# EAGLE design DAU_Kupplung_1_phasig_V1_16 (EAGLE 6.1)
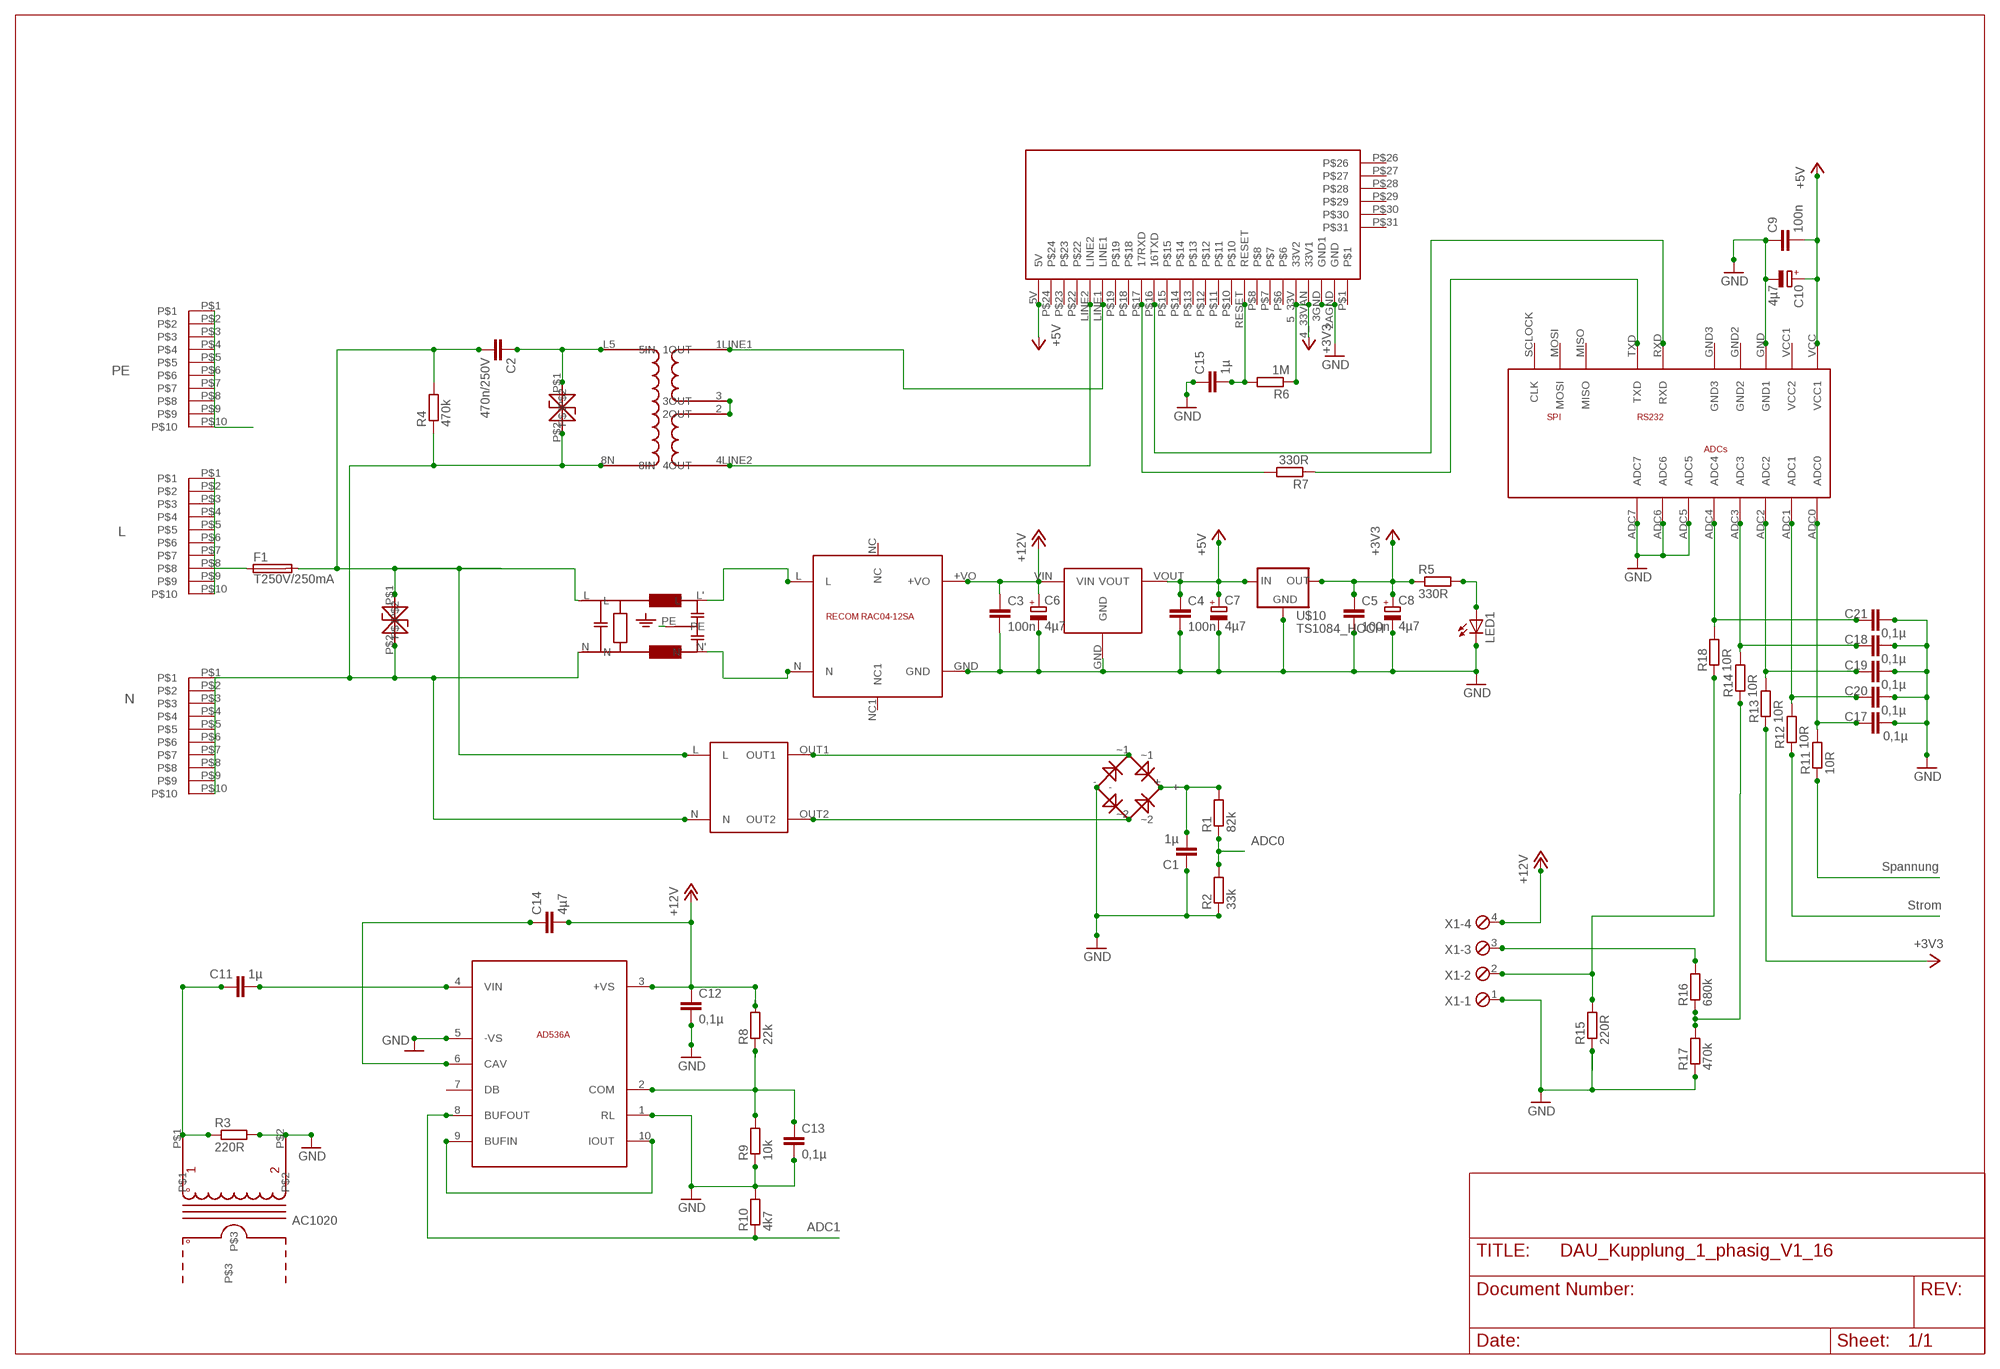
[diagram p0: schematic, sheet 1]

## Parts
AC1020  AC1010  [AC1010]
C1  1µ  C2,5-3  [C2.5-3]
C2  470n/250V  C-EU150-072X183  [C150-072X183]
C3  100n  C-EUC0805  [C0805]
C4  100n  C-EUC0805  [C0805]
C5  100n  C-EUC0805  [C0805]
C6  4µ7  CPOL-EUE2-4  [E2-4]
C7  4µ7  CPOL-EUE2-4  [E2-4]
C8  4µ7  CPOL-EUE2-4  [E2-4]
C9  100n  C-EUC0805  [C0805]
C10  4µ7  CPOL-EUE2-4  [E2-4]
C11  1µ  C-EUC0805  [C0805]
C12  0,1µ  C-EUC0805  [C0805]
C13  0,1µ  C-EUC0805  [C0805]
C14  4µ7  C-EUC0805  [C0805]
C15  1µ  C-EUC0805  [C0805]
C17  0,1µ  C-EUC0805  [C0805]
C18  0,1µ  C-EUC0805  [C0805]
C19  0,1µ  C-EUC0805  [C0805]
C20  0,1µ  C-EUC0805  [C0805]
C21  0,1µ  C-EUC0805  [C0805]
F1  T250V/250mA  TR5  [TR5]
L  PRINT_CONNECTOR  [FASTON_DOUBLE]
LED1  LEDSQR2X5  [LED2X5]
N  PRINT_CONNECTOR  [FASTON_DOUBLE]
PE  PRINT_CONNECTOR  [FASTON_DOUBLE]
R1  82k  R-EU_R1206  [R1206]
R2  33k  R-EU_R1206  [R1206]
R3  220R  R-EU_R1206  [R1206]
R4  470k  R-EU_0204/7  [0204/7]
R5  330R  R-EU_R1206  [R1206]
R6  1M  R-EU_R1206  [R1206]
R7  330R  R-EU_R1206  [R1206]
R8  22k  R-EU_R1206  [R1206]
R9  10k  R-EU_R1206  [R1206]
R10  4k7  R-EU_R1206  [R1206]
R11  10R  R-EU_R1206  [R1206]
R12  10R  R-EU_R1206  [R1206]
R13  10R  R-EU_R1206  [R1206]
R14  10R  R-EU_R1206  [R1206]
R15  220R  R-EU_R1206  [R1206]
R16  680k  R-EU_R1206  [R1206]
R17  470k  R-EU_R1206  [R1206]
R18  10R  R-EU_R1206  [R1206]
U$1  RECOM_RAC04_12SA  [RAC04_12SA]
U$2  SICHERHEITSTRAFO  [TRAFO_0,35VA]
U$3  ADUC831_MINIMUM  [ADUC_MINIMUM]
U$4  IT800  [IT800]
U$5  PLC_UEBERTRAGER_V2  [PLC-UEBERTRAGER_V2]
U$6  NETZFILTER_05_A  [NETZFILTER]
U$7  AD536  [TO100_10PIN]
U$8  RECTIFIER  [RECTIFIER]
U$9  TSV  [TSV]
U$10  TS1084_HOCH  [TS1084_HOCH]
U$11  RECOM_785_05  [RECOM785X]
U$12  TSV  [TSV]
X1  MPT4  [4POL254]

## Nets
+3V3: C5.1 C8.+ R5.1 R6.1 R13.1 U$4.4_33VAN(33V1) U$4.5_33V(33V2) U$10.OUT
+5V: C4.1 C7.+ C9.2 C10.+ U$3.VCC(VCC1) U$4.5V U$10.IN U$11.VOUT
+12V: C3.1 C6.+ C12.1 C14.2 R8.2 U$1.+VO U$7.3(+VS) U$11.VIN X1.4
ADC0: R1.1 R2.2 R11.1
ADC1: R10.1 R12.1 U$7.8(BUFOUT)
GND: AC1020.P$2 C1.1 C3.2 C4.2 C5.2 C6.- C7.- C8.- C9.1 C10.- C12.2 C13.2 C15.1 C17.2 C18.2 C19.2 C20.2 C21.2 LED1.K(C) R2.1 R3.2 R9.1 R10.2 R15.1 R17.1 U$1.GND U$3.ADC5 U$3.ADC6 U$3.ADC7 U$3.GND(GND1) U$4.2AGND(GND) U$4.3GND(GND1) U$7.1(RL) U$7.5(-VS) U$8.- U$10.GND U$11.GND X1.1
N$1: U$5.2(2OUT) U$5.3(3OUT)
N$2: U$7.9(BUFIN) U$7.10(IOUT)
N$3: R7.2 U$4.P$17(17RXD)
N$4: U$2.OUT1 U$8.~1
N$5: U$4.LINE1 U$5.1LINE1(1OUT)
N$6: F1.1 L.P$1 L.P$2 L.P$3 L.P$4 L.P$5 L.P$6 L.P$7 L.P$8 L.P$9 L.P$10
N$7: C1.2 R1.2 U$8.+
N$8: AC1020.P$1 C11.1 R3.1
N$9: U$2.OUT2 U$8.~2
N$10: C11.2 U$7.4(VIN)
N$11: C2.1 U$5.L5(5IN) U$12.P$1
N$13: U$4.LINE2 U$5.4LINE2(4OUT)
N$14: R7.1 U$3.TXD
N$15: U$3.RXD U$4.P$16(16TXD)
N$16: C14.1 U$7.6(CAV)
N$17: C21.1 R18.2 U$3.ADC4
N$18: U$1.L U$6.L'
N$19: LED1.A R5.2
N$20: C15.2 R6.2 U$4.RESET
N$21: C13.1 R8.1 R9.2 U$7.2(COM)
N$22: U$1.N U$6.N'
N$23: N.P$1 N.P$2 N.P$3 N.P$4 N.P$5 N.P$6 N.P$7 N.P$8 N.P$9 N.P$10 R4.1 U$2.N U$5.8N(8IN) U$6.N U$9.P$2 U$12.P$2
N$24: C2.2 F1.2 R4.2 U$2.L U$6.L U$9.P$1
N$27: C18.1 R14.2 U$3.ADC3
N$28: C19.1 R13.2 U$3.ADC2
N$29: C20.1 R12.2 U$3.ADC1
N$30: C17.1 R11.2 U$3.ADC0
N$31: R15.2 R18.1 X1.2
N$32: R16.2 X1.3
N$33: R14.1 R16.1 R17.2
PE: PE.P$1 PE.P$2 PE.P$3 PE.P$4 PE.P$5 PE.P$6 PE.P$7 PE.P$8 PE.P$9 PE.P$10 U$6.PE
Unconnected: AC1020.P$3 U$1.NC U$1.NC1 U$3.GND2 U$3.GND3 U$3.MISO U$3.MOSI U$3.SCLOCK(CLK) U$3.VCC1(VCC2) U$4.P$1 U$4.P$6 U$4.P$7 U$4.P$8 U$4.P$10 U$4.P$11 U$4.P$12 U$4.P$13 U$4.P$14 U$4.P$15 U$4.P$18 U$4.P$19 U$4.P$22 U$4.P$23 U$4.P$24 U$4.P$26 U$4.P$27 U$4.P$28 U$4.P$29 U$4.P$30 U$4.P$31 U$7.7(DB)

## Notes on the sheet
- PE
- L
- N
- ADC0
- Spannung
- Strom
- AC1020
- ADC1

## Library data of the parts
AC1020 = ADS:AC1010
C1 = capacitor-wima:C: CAPACITOR naming: grid - package width
C2-C5 C15 C17-C21 = resistor:C-EU: CAPACITOR, European symbol
C6-C8 C10 = rcl:CPOL-EU: POLARIZED CAPACITOR, European symbol
C9 C11-C14 = rcl:C-EU: CAPACITOR, European symbol
F1 = fuse:TR5: FUSE Wickmann; OC_FARNELL: unknown; OC_NEWARK: unknown
L N PE = ADS:PRINT_CONNECTOR
LED1 = led:LED: LED OSRAM: - CHIPLED LG R971, LG N971, LY N971, LG Q971, LY Q971, LO R971, LY R971 LH N974, LH R974 LS Q976, LO Q976, LY Q976 LO Q996 - Hyper CHIPLED LW Q18S LB Q993, LB Q99A, LB R99A - SideLED LS A670, LO A670, LY A670, LG A670, LP A670 LB A673, LV A673, LT A673, LW A673 LH A674 LY A675 LS A676, LA A676, LO A676, LY A676, LW A676 LS A679, LY A679, LG A679 - Hyper Micro SIDELED® LS Y876, LA Y876, LO Y876, LY Y876 LT Y87S - SmartLED LW L88C, LW L88S LB L89C, LB L89S, LG L890 LS L89K, LO L89K, LY L89K LS L896, LA L896, LO L896, LY L896 - TOPLED LS T670, LO T670, LY T670, LG T670, LP T670 LSG T670, LSP T670, LSY T670, LOP T670, LYG T670 LG T671, LOG T671, LSG T671 LB T673, LV T673, LT T673, LW T673 LH T674 LS T676, LA T676, LO T676, LY T676, LB T676, LH T676, LSB T676, LW T676 LB T67C, LV T67C, LT T67C, LS T67K, LO T67K, LY T67K, LW E67C LS E67B, LA E67B, LO E67B, LY E67B, LB E67C, LV E67C, LT E67C LW T67C LS T679, LY T679, LG T679 LS T770, LO T770, LY T770, LG T770, LP T770 LB T773, LV T773, LT T773, LW T773 LH T774 LS E675, LA E675, LY E675, LS T675 LS T776, LA T776, LO T776, LY T776, LB T776 LHGB T686 LT T68C, LB T68C - Hyper Mini TOPLED® LB M676 - Mini TOPLED Santana® LG M470 LS M47K, LO M47K, LY M47K Source: http://www.osram.convergy.de LUXEON: - LUMILED® LXK2-PW12-R00, LXK2-PW12-S00, LXK2-PW14-U00, LXK2-PW14-V00 LXK2-PM12-R00, LXK2-PM12-S00, LXK2-PM14-U00 LXK2-PE12-Q00, LXK2-PE12-R00, LXK2-PE12-S00, LXK2-PE14-T00, LXK2-PE14-U00 LXK2-PB12-K00, LXK2-PB12-L00, LXK2-PB12-M00, LXK2-PB14-N00, LXK2-PB14-P00, LXK2-PB14-Q00 LXK2-PR12-L00, LXK2-PR12-M00, LXK2-PR14-Q00, LXK2-PR14-R00 LXK2-PD12-Q00, LXK2-PD12-R00, LXK2-PD12-S00 LXK2-PH12-R00, LXK2-PH12-S00 LXK2-PL12-P00, LXK2-PL12-Q00, LXK2-PL12-R00 Source: www.luxeon.com KINGBRIGHT: KA-3528ASYC Source: www.kingbright.com
R1-R18 = resistor:R-EU_: RESISTOR, European symbol
U$1 = ADS:RECOM_RAC04_12SA
U$2 = ADS:SICHERHEITSTRAFO
U$3 = ADS_ADUCBoards:ADUC831_MINIMUM
U$4 = ADS:IT800
U$5 = ADS1:PLC_UEBERTRAGER_V2
U$6 = ADS:NETZFILTER_05_A
U$7 = ADS:AD536
U$8 = ADS:RECTIFIER
U$9 U$12 = ADS:TSV
U$10 = ADS:TS1084_HOCH
U$11 = ADS:RECOM_785_05
X1 = con-phoenix-254:MPT4: PHOENIX CONNECTOR; OC_FARNELL: unknown; OC_NEWARK: unknown

## Board
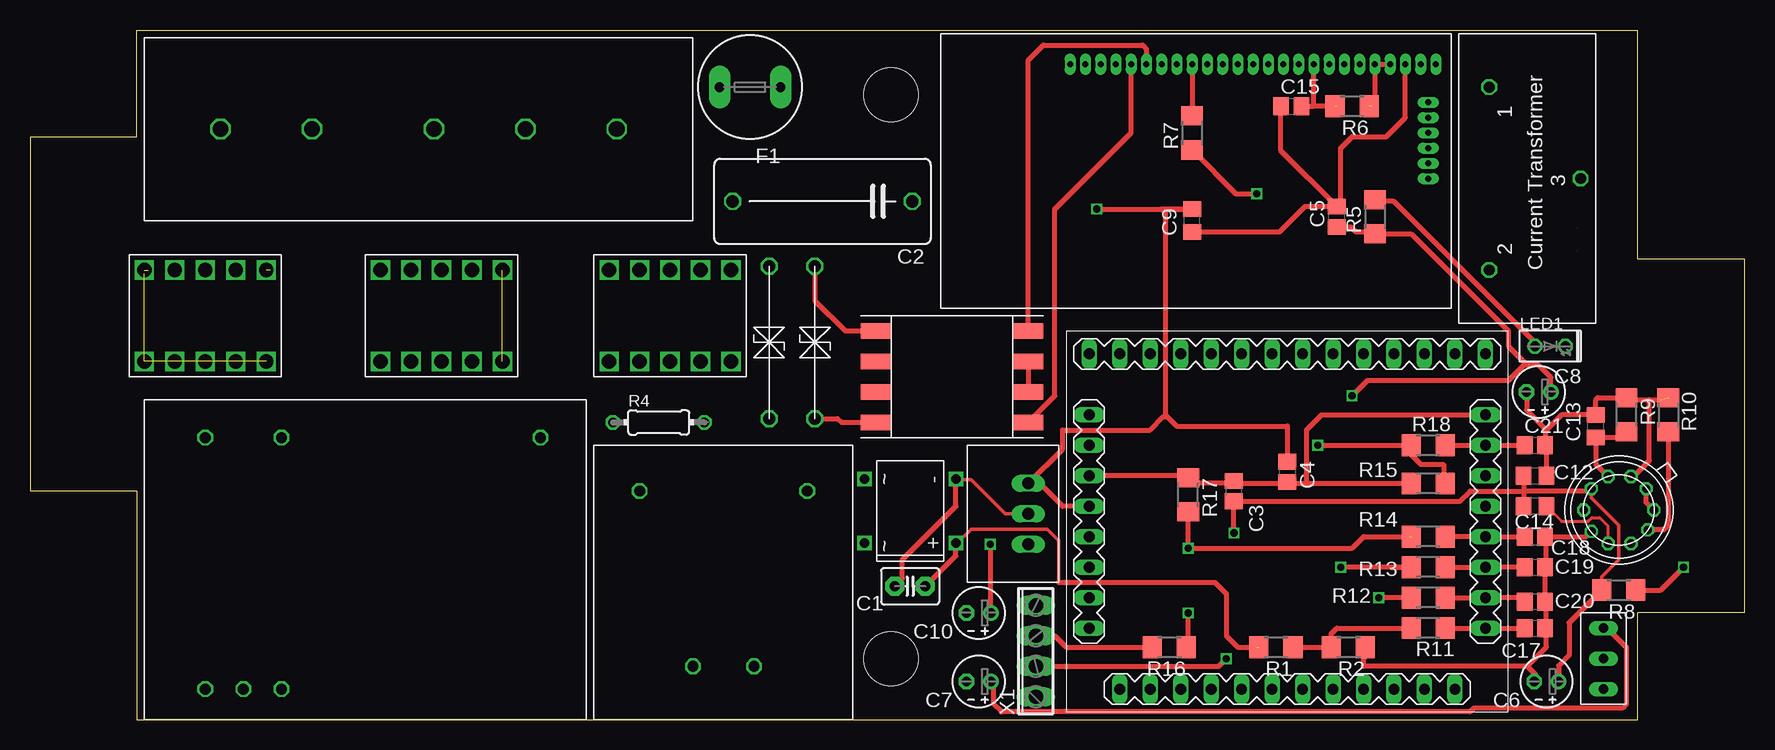
[diagram p1: board, top side]
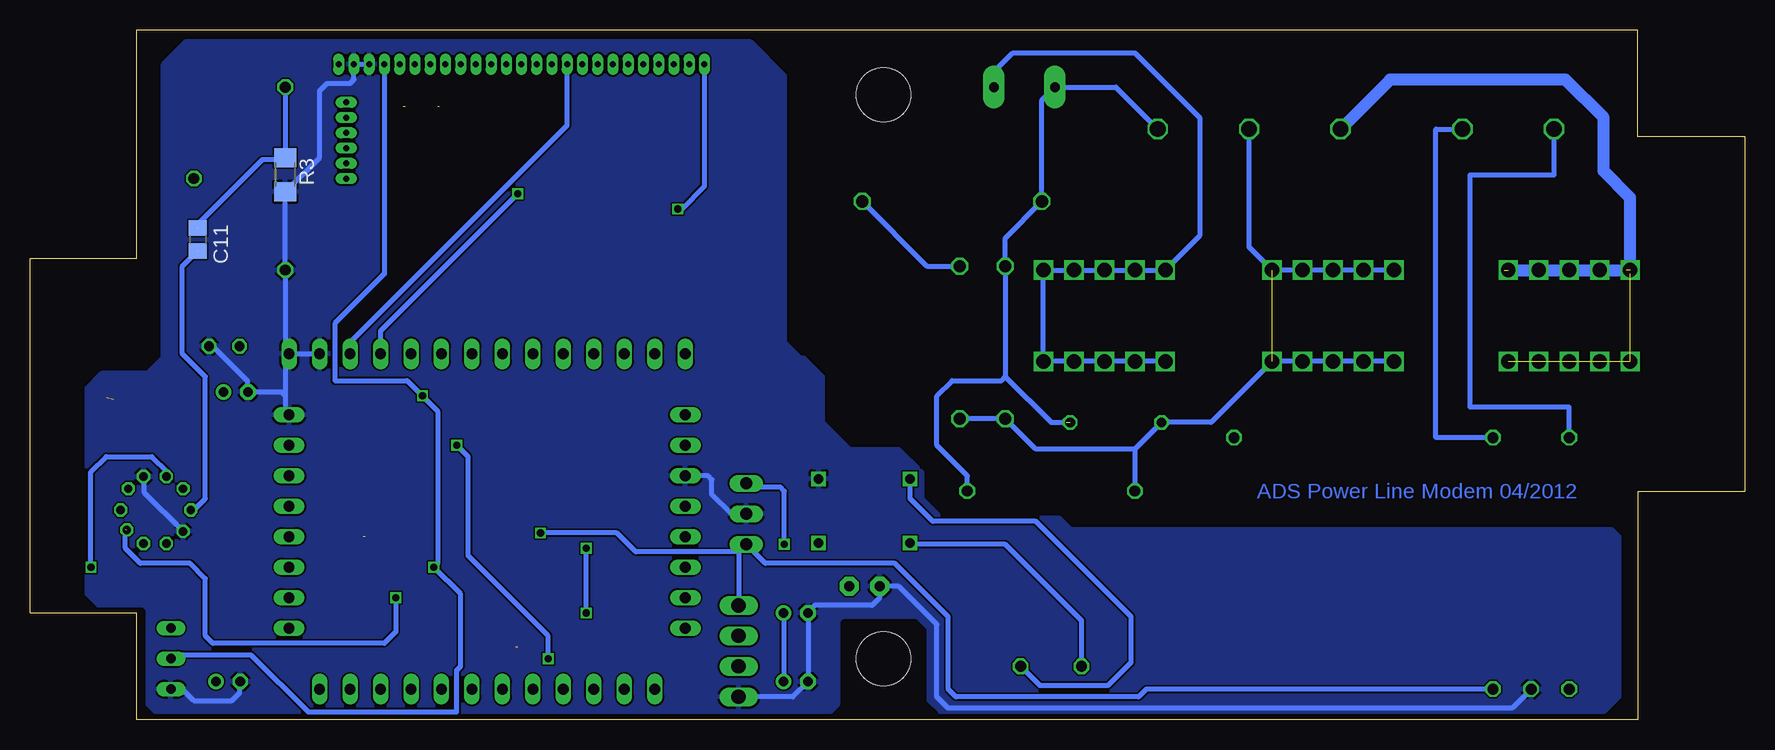
[diagram p2: board, bottom side, seen from below]

Size 142.88 x 57.47 mm. Coordinates in mm from the lower left corner, seen from the top.
Outline: 8.89,0 133.99,0 133.99,8.89 142.88,8.89 142.88,38.42 133.99,38.42 133.99,57.47 8.89,57.47 8.89,48.58 0,48.58 0,19.05 8.89,19.05 8.89,0
Copper layers (1*16): Top 0.035mm / dielectric 1.5mm / Bottom 0.035mm
Design rules: minimum track width 0.15mm, minimum drill 0.3mm, track to track 0.15mm, track to pad 0.15mm, pad to pad 0.15mm, via to via 0.15mm, smd to smd 0.15mm, copper to edge 0.3mm, drill to drill 0.2mm, minimum pad ring 0.2mm, minimum via ring 0.15mm, stop-mask expansion 0.075mm, vias tented up to drill 0mil, thermal gap 0.2mm
Holes 4.5 mm at 71.75,52.07 71.75,5.08

### Footprints (pad centres in the part's own frame; a part is rotated, then mirrored left to right if it is on the bottom)
AC1010 = drill 0.9 octagon: P$1 20.32,8.89; P$2 5.08,8.89; P$3 12.7,1.27
C2.5-3 = drill 0.813 pad 1.6 octagon: 1 -1.27,0; 2 1.27,0
C150-072X183 = drill 1.016 octagon: 1 -7.493,0; 2 7.493,0
C0805 = smd 1.3 x 1.5: 1 -0.85,0; 2 0.85,0
E2-4 = drill 0.813 pad 1.27: + -1.016,0 | drill 0.813 pad 1.27 octagon: - 1.016,0
C0805' = smd 1.3 x 1.5: 1 -0.95,0; 2 0.95,0
TR5 = drill 0.813 pad 1.778 long: 1 -2.54,0; 2 2.54,0
FASTON_DOUBLE = drill 1.2 square: P$1 -5.08,-3.81; P$2 -2.54,-3.81; P$3 -5.08,3.81; P$4 -2.54,3.81; P$5 0,3.81; P$6 2.54,3.81; P$7 5.08,3.81; P$8 0,-3.81; P$9 2.54,-3.81; P$10 5.08,-3.81
LED2X5 = drill 0.813 octagon: A -1.27,0; K 1.27,0
R1206 = smd 1.6 x 1.803: 1 -1.422,0; 2 1.422,0
0204/7 = drill 0.813 octagon: 1 -3.81,0; 2 3.81,0
RAC04_12SA = drill 0.9 octagon: +VO 25.4,24.13; GND 28.575,24.13; L 31.75,3.175; N 25.4,3.175; NC 3.81,3.175; NC1 31.75,24.13
TRAFO_0,35VA = drill 0.9 octagon: L 3.81,17.78; N 3.81,3.81; OUT1 18.415,13.335; OUT2 18.415,8.255
ADUC_MINIMUM = drill 0.9 long: ADC0 -9.207,-16.51; ADC1 -6.668,-16.51; ADC2 -4.128,-16.51; ADC3 -1.587,-16.51; ADC4 6.032,-16.51; ADC5 8.572,-16.51; ADC6 13.652,-16.51; ADC7 13.652,-13.97; ALE -14.287,6.35; DAC0 0.953,-16.51; DAC1 3.493,-16.51; GND 3.493,16.51; GND2 -4.128,16.51; GND3 -6.668,16.51; INT0 13.652,-6.35; MISO 13.652,-3.81; MOSI 13.652,11.43; P00 -14.287,3.81; P01 -14.287,1.27; P02 -14.287,-1.27; P03 -14.287,-3.81; P04 -14.287,-6.35; P05 -14.287,-8.89; P06 -14.287,-11.43; P07 -14.287,-13.97; P20 13.652,13.97; P21 13.652,16.51; P22 8.572,16.51; P23 6.032,16.51; P24 -9.207,16.51; P25 -14.287,13.97; P34 13.652,-1.27; P35 13.652,1.27; P36 13.652,3.81; P37 13.652,6.35; PWM0 -14.287,11.43; PWM1 -14.287,8.89; RXD 13.652,-11.43; SCLOCK 13.652,8.89; TXD 13.652,-8.89; VCC 0.953,16.51; VCC1 -1.587,16.51
IT800 = drill 0.5 long: 2AGND 2.54,2.54; 3GND 3.81,2.54; 4_33VAN 5.08,2.54; 5_33V 6.35,2.54; 5V 31.75,2.54; LINE1 25.4,2.54; LINE2 26.67,2.54; P$1 1.27,2.54; P$6 7.62,2.54; P$7 8.89,2.54; P$8 10.16,2.54; P$10 12.7,2.54; P$11 13.97,2.54; P$12 15.24,2.54; P$13 16.51,2.54; P$14 17.78,2.54; P$15 19.05,2.54; P$16 20.32,2.54; P$17 21.59,2.54; P$18 22.86,2.54; P$19 24.13,2.54; P$22 27.94,2.54; P$23 29.21,2.54; P$24 30.48,2.54; P$26 1.905,5.715; P$27 1.905,6.985; P$28 1.905,8.255; P$29 1.905,9.525; P$30 1.905,10.795; P$31 1.905,12.065; RESET 11.43,2.54
PLC-UEBERTRAGER_V2 = smd 2.54 x 1.27: 1LINE1 6.35,3.81; 2 6.35,1.27; 3 6.35,-1.27; 4LINE2 6.35,-3.81; 6NC -6.35,1.27; 7NC -6.35,-1.27; 8N -6.35,-3.81; L5 -6.35,3.81
NETZFILTER = drill 1.3 octagon: L 6.35,7.62; L' 39.37,7.62; N 13.97,7.62; N' 31.75,7.62; PE 21.59,7.62
TO100_10PIN = drill 0.7 octagon: 1 2.794,-1.016; 2 2.794,0.889; 3 1.778,2.286; 4 0,2.921; 5 -1.778,2.286; 6 -2.794,0.889; 7 -2.794,-1.016; 8 -1.651,-2.413; 9 0,-2.921; 10 1.778,-2.286
RECTIFIER = drill 0.8 square: + 6.858,7.62; - 1.524,7.62; ~1 1.524,0; ~2 6.858,0
TSV = drill 1 octagon: P$1 -5.08,0; P$2 7.62,0
TS1084_HOCH = drill 0.8 long: GND 0,0; IN 5.08,0; OUT 2.54,0
RECOM785X = drill 1 long: GND 0,2.54; VIN -2.54,2.54; VOUT 2.54,2.54
4POL254 = drill 1.2 long: 1 -3.81,0; 2 -1.27,0; 3 1.27,0; 4 3.81,0

### Placement (x,y rotation side)
AC1020  130.49,32.38 90 top
C1  73.34,11.11 0 top
C2  66.04,43.18 180 top
C3  100.33,19.05 90 top
C4  104.78,20.64 270 top
C5  108.9,41.91 90 top
C6  126.36,3.17 180 top
C7  79.06,3.17 180 top
C8  125.73,27.3 180 top
C9  100n  [C0805']  96.84,41.59 90 top
C10  79.06,8.89 180 top
C11  1µ  [C0805']  128.91,40.01 270 bottom
C12  0,1µ  [C0805']  125.41,20.32 0 top
C13  0,1µ  [C0805']  130.49,24.45 90 top
C14  4µ7  [C0805']  125.41,17.78 180 top
C15  105.09,51.12 0 top
C17  125.41,7.62 0 top
C18  125.41,15.24 0 top
C19  125.41,12.7 0 top
C20  125.41,9.84 0 top
C21  125.41,22.86 0 top
F1  60.01,52.7 180 top
L  53.34,33.66 0 top
LED1  126.68,31.11 0 top
N  34.29,33.66 0 top
PE  14.61,33.66 0 top
R1  103.82,6.03 180 top
R2  109.86,6.03 180 top
R3  121.6,45.4 270 bottom
R4  52.39,24.77 0 top
R5  112.08,41.91 90 top
R6  110.17,51.12 180 top
R7  96.84,48.9 90 top
R8  132.4,10.79 180 top
R9  133.03,25.4 270 top
R10  136.53,25.4 90 top
R11  116.52,7.62 0 top
R12  116.52,10.16 0 top
R13  116.52,12.7 0 top
R14  116.52,15.24 0 top
R15  116.52,19.68 0 top
R16  94.93,6.03 180 top
R17  96.52,18.73 270 top
R18  116.52,22.86 0 top
U$1  46.35,26.67 180 top
U$2  46.99,22.86 270 top
U$3  104.78,16.83 90 top
U$4  118.43,57.15 180 top
U$5  76.83,28.57 0 top
U$6  55.24,56.83 180 top
U$7  132.4,17.46 90 top
U$8  69.53,21.59 270 top
U$9  61.59,32.7 270 top
U$10  131.13,2.54 90 top
U$11  85.72,17.14 90 top
U$12  65.41,32.7 270 top
X1  83.82,5.71 90 top

### Tracks (layer width: path | path; a pad name or v marks a point on that pad's centre or on a via)
+3V3  (via drill 0.6)  (1 unrouted)
  Top 0.406: U$4.4_33VAN U$4.5_33V 112.08,51.44 111.76,51.12 | 113.35,12.7 R13.1 v109.22,12.7 | C5.1 110.07,41.06 110.49,40.64 111.92,40.64 R5.1 115.09,40.49 123.19,32.38 123.19,31.11 124.78,29.53 | 126.68,28.57 125.73,29.53 124.78,29.53 | 126.68,28.57 126.68,27.37 C8.+ 126.75,28.51 126.68,28.57 | 124.78,29.53 124.46,29.53 123.19,28.26 111.44,28.26 v110.17,26.99
  Bottom 0.406: U$10.OUT 130.81,5.4 124.46,5.4 119.7,0.64 107.31,0.64 107.31,4.13 107,4.45 107,10.48 v109.22,12.7 108.9,13.02 108.9,25.72 v110.17,26.99 111.44,28.26 117.47,28.26 117.47,33.02 113.35,37.15 U$4.4_33VAN
+5V  (via drill 0.6)
  Top 0.305: 80.07,14.54 v80.01,14.61
  Top 0.406: v88.9,42.55 v88.9,42.54 C9.2 94.3,42.55 94.61,42.23 94.61,25.4 94.77,25.24 | 94.77,25.24 95.57,24.45 104.78,24.45 C4.1 | U$3.VCC 86.04,17.78 84.14,19.68 U$11.VOUT 86.04,22.54 86.04,24.13 93.34,24.13 94.46,25.24 94.77,25.24 | U$10.IN 131.44,7.62 133.03,6.03 133.03,1.27 132.72,0.95 120.33,0.95 120.02,0.64 80.96,0.64 80.33,1.27 80.33,2.92 C7.+ | C10.+ 80.07,14.54
  Bottom 0.406: C10.+ C7.+ | U$4.5V 86.68,44.45 88.58,42.55 v88.9,42.55 | v80.01,14.61 80.01,19.05 80.33,19.37 82.87,19.37 U$11.VOUT
+12V  (via drill 0.6)
  Top 0.305: R8.2 130.98,11.91 132.4,13.34 132.4,16.19 130.11,18.48 U$7.3
  Top 0.406: R8.2 128.27,8.09 128.27,5.4 127.38,4.51 C6.+ | C12.1 124.46,19.05 | 124.46,19.05 C14.2 | U$7.3 129.92,19.05 124.46,19.05 | v100.33,15.56 C3.1 119.17,18.2 120.02,19.05 124.46,19.05
  Bottom 0.406: U$1.+VO 49.85,2.54 50.48,1.91 65.72,1.91 66.36,2.54 66.36,8.57 70.8,13.02 81.6,13.02 U$11.VIN 83.82,13.97 | 83.82,13.97 X1.4 | 83.82,13.97 92.39,13.97 93.98,15.56 v100.33,15.56
ADC0
  Top 0.406: R1.1 R2.2 108.43,7.15 108.9,7.62 R11.1
ADC1  (via drill 0.6)  (1 unrouted)
  Top 0.406: R10.1 136.53,16.19 136.14,15.81 U$7.8 | R12.1 v112.39,10.16
  Bottom 0.406: v112.39,10.16 112.39,7.3 113.35,6.35 127.64,6.35 128.27,6.99 128.27,11.75 129.54,13.02 133.67,13.02 134.94,14.29 134.94,15.88
GND  (1 unrouted)
  Top 0.305: 77.15,20 78.42,20 81.28,17.14 U$11.GND
  Top 0.406: C1.1 72.71,11.75 72.71,13.34 77.15,17.78 77.15,20 | C8.- 124.71,25.78 126.36,24.13 | 126.36,24.13 127.63,25.4 C13.2 130.49,26.67 130.64,26.82 R9.1 133.19,26.67 134.94,26.67 | 124.78,4.45 126.36,6.03 126.36,7.52 | 126.36,7.52 126.36,9.74 C20.2 C19.2 126.36,12.7 126.36,15.14 C18.2 129.67,15.24 U$7.5 | 126.36,24.13 126.26,24.03 C21.2 126.36,22.76 C12.2 | 134.94,26.67 135.89,26.67 | 114.89,19.9 R15.1 106.36,19.68 | 95.89,19.68 100.11,19.68 C3.2 100.55,19.68 105.41,19.68 | R17.1 96.36,20.32 U$3.GND | 105.41,19.68 106.36,19.68 | U$3.ADC5 107.63,25.4 106.36,24.13 106.36,19.68 | 124.78,4.45 111.12,4.45 111.12,5.08 111.28,5.23 R2.1 | 134.94,26.67 134.94,21.59 133.67,20.32 133.48,20.32 U$7.1 | C9.1 104.14,40.64 106.26,42.76 C5.2 | C5.2 104.24,47.42 C15.1 | C5.2 109.22,42.76 109.22,47.62 110.17,48.58 113.03,48.58 114.62,50.16 U$4.3GND | 124.78,4.45 125.41,3.81 125.41,3.24 C6.- | C4.2 105.31,19.79 105.41,19.68 | 126.36,7.52 C17.2
  Bottom 0.406: U$1.GND 19.37,0.95 66.36,0.95 67.31,1.91 67.31,7.94 70.48,11.11 C1.1 | C1.1 72.39,11.11 | X1.1 79.31,1.91 C7.- C10.- 78.11,8.89 77.47,9.53 72.71,9.53 72.07,10.16 C1.1 | U$11.GND 84.45,17.14 86.04,18.73 86.04,20 86.36,20.32 U$3.GND | 121.6,30.8 AC1020.P$2 R3.2 118.75,46.84 118.75,52.39 118.11,53.02 116.2,53.02 115.89,53.34 U$4.2AGND U$4.3GND | 121.6,30.8 U$3.ADC6 U$3.ADC7 | 121.6,30.8 121.6,26.99 | 121.6,26.99 121.6,25.72 U$3.ADC5 | 121.6,26.99 121.92,27.3 C8.- 124.78,27.37 124.78,28.26 127.64,31.11 LED1.K | U$7.5 133.35,18.92 133.35,20.32 U$7.1 | U$10.GND 130.18,2.54 129.22,1.59 126.05,1.59 125.41,2.22 125.41,3.11 C6.-
  pour Bottom: 10.48,15.24 10.48,1.91 11.75,0.64 66.99,0.64 67.94,1.59 67.94,7.62 68.9,8.57 75.25,8.57 75.56,8.26 75.56,1.27 76.2,0.64 132.4,0.64 133.03,1.27 133.03,9.21 133.35,9.53 137.16,9.53 138.11,10.48 138.11,27.62 136.84,28.89 133.03,28.89 131.76,30.16 131.76,54.61 129.86,56.52 82.87,56.52 80.01,53.66 80.01,31.43 78.74,30.16 78.42,30.16 76.83,28.57 76.83,24.77 74.61,22.54 70.48,22.54 68.58,20.64 68.58,18.41 66.99,16.83 57.15,16.83 56.2,15.88 11.11,15.88
N$1
  Top 0.406: U$5.2 U$5.3
N$2
  Top 0.406: U$7.9 134.68,18.1 U$7.10
N$3
  Top 0.406: U$4.P$17 R7.2
N$4
  Bottom 0.406: U$8.~1 69.53,18.41 67.63,16.51 59.05,16.51 51.12,8.57 51.12,4.76 53.02,2.86 58.74,2.86 U$2.OUT1
N$5
  Top 0.406: U$5.1LINE1 83.19,54.93 84.45,56.2 92.71,56.2 93.03,55.88 U$4.LINE1
N$6
  Bottom 0.406: L.P$1 L.P$2 L.P$8 L.P$9 L.P$10 L.P$7 L.P$6 L.P$5 L.P$4 L.P$3 45.4,40.32 45.4,50.16 50.8,55.56 60.96,55.56 62.55,53.98 F1.1
N$7  (1 unrouted)
  Top 0.305: 85.72,11.43 85.72,14.92 84.77,15.88 78.42,15.88 77.15,14.61
  Top 0.406: C1.2 77.15,13.65 77.15,14.61 U$8.+ | 85.72,11.43 98.74,11.43 99.69,10.48 99.69,6.99 100.65,6.03 102.23,6.03
N$8  (1 unrouted)
  Bottom 0.406: AC1020.P$1 R3.1 | R3.1 121.6,46.67 | R3.1 121.75,46.67 123.51,46.67 128.91,41.27 C11.1
N$9
  Bottom 0.406: U$2.OUT2 55.24,8.26 61.59,14.61 69.41,14.61 U$8.~2
N$10  (1 unrouted)
  Bottom 0.406: U$7.4 129.22,17.46 128.27,18.41 128.27,28.57 130.18,30.48 130.18,37.78 C11.2
N$11
  Top 0.406: U$12.P$1 65.41,34.92 67.94,32.38 U$5.L5
  Bottom 0.406: C2.1 68.14,37.78 U$12.P$1
N$13
  Top 0.406: U$5.4LINE2 85.41,26.99 85.41,42.55 91.76,48.9 U$4.LINE2
N$14  (via drill 0.6)
  Top 0.406: R7.1 100.5,43.81 v102.23,43.81
  Bottom 0.406: v102.23,43.81 113.67,32.38 U$3.TXD
N$15
  Bottom 0.406: U$3.RXD 116.2,31.43 98.11,49.53 U$4.P$16
N$16
  Top 0.254: U$7.6 131.51,16.13 130.81,16.83 130.18,16.83 129.86,16.51 127.63,16.51 C14.1
N$17
  Top 0.406: R18.2 U$3.ADC4 C21.1
N$18
  Bottom 0.406: U$1.L 14.61,26.04 22.86,26.04 22.86,45.4 15.88,45.4 U$6.L'
N$19
  Top 0.406: LED1.A 125.41,31.43 113.67,43.18 112.23,43.18 R5.2
N$20  (1 unrouted)
  Top 0.406: 108.9,51.12 107,51.12 | C15.2 107,51.12 | 107,51.12 U$4.RESET
N$21  (via drill 0.6)
  Top 0.406: C13.1 | C13.1 130.49,21.27 U$7.2 | R9.2 132.55,23.5 C13.1 | R8.1 135.89,10.79 v137.79,12.7
  Bottom 0.406: v137.79,12.7 137.79,20.64 136.53,21.91 132.72,21.91 131.44,20.64 131.44,20.19 | 131.44,20 131.44,20.19 | 131.44,20.19 U$7.2
N$22
  Bottom 0.406: U$1.N 25.72,23.5 25.72,49.21 U$6.N'
N$23  (1 unrouted)
  Top 0.406: U$12.P$2 67.31,25.08 67.63,24.77 U$5.8N
  Bottom 0.406: N.P$3 N.P$4 N.P$5 N.P$6 N.P$7 41.27,39.37 U$6.N | N.P$1 N.P$2 N.P$8 N.P$9 N.P$10 44.45,24.77 R4.1 50.8,22.54 | 50.8,22.54 U$2.N | 50.8,22.54 59.05,22.54 U$9.P$2 U$12.P$2
N$24  (1 unrouted)
  Bottom 0.406: U$6.L 52.39,52.7 F1.2 58.55,51.63 C2.2 61.59,40.13 U$9.P$1 61.59,28.57 | 61.59,28.57 57.78,24.77 56.52,24.77 56.2,24.45 | U$2.L 64.77,20.32 67.31,22.86 67.31,26.99 66.04,28.26 61.91,28.26 61.59,28.57
N$27
  Top 0.406: C18.1 U$3.ADC3 R14.2
N$28
  Top 0.406: R13.2 U$3.ADC2 C19.1
N$29
  Top 0.406: R12.2 U$3.ADC1 124.25,10.16 C20.1
N$30
  Top 0.406: R11.2 U$3.ADC0 C17.1
N$31  (via drill 0.6)
  Top 0.406: R15.2 117.79,19.84 117.79,21.27 115.89,21.27 115.1,22.06 R18.1 v107.31,22.86 | X1.2 99.06,4.45 v99.69,5.08
  Bottom 0.406: v99.69,5.08 99.69,6.99 106.36,13.65 106.36,21.91 v107.31,22.86
N$32
  Top 0.406: X1.3 85.41,6.99 86.36,6.03 R16.2
N$33  (via drill 0.6)  (1 unrouted)
  Top 0.406: R16.1 96.52,6.2 v96.52,8.89 | R17.2 v96.52,14.29 110.17,14.29 111.12,15.24 114.94,15.24
  Bottom 0.406: v96.52,8.89 v96.52,14.29
PE  (7 unrouted)
  Bottom 1.016: 20,37.47 PE.P$6 PE.P$5 PE.P$4 9.84,37.47 9.53,37.15 9.53,43.5 11.75,45.72 11.75,50.16 14.92,53.34 29.53,53.34 U$6.PE

### Text on the board
Bottom: ADS Power Line Modem 04/2012